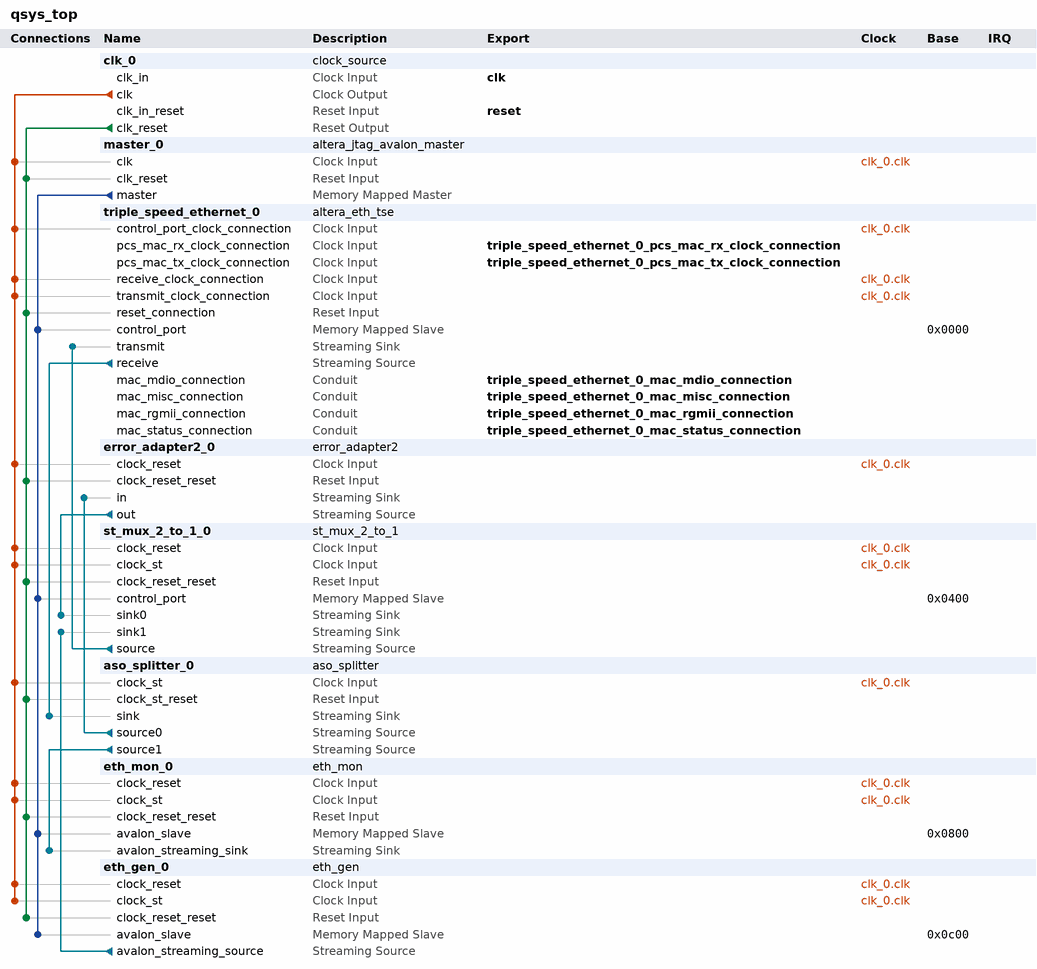
[diagram p0: system contents]
# Platform Designer (Qsys) system qsys_top, MAX 10 10M50DAF484C6GES
# Parameters at their usual value, and those the tool derives, are not listed.
package require -exact qsys 15.1
create_system qsys_top
set_project_property DEVICE_FAMILY {MAX 10}
set_project_property DEVICE 10M50DAF484C6GES

add_instance clk_0 clock_source 15.1
set_instance_parameter_value clk_0 clockFrequency 100000000

add_instance master_0 altera_jtag_avalon_master 15.1

add_instance triple_speed_ethernet_0 altera_eth_tse 15.1
set_instance_parameter_value triple_speed_ethernet_0 core_variation MAC_ONLY
set_instance_parameter_value triple_speed_ethernet_0 eg_addr 13
set_instance_parameter_value triple_speed_ethernet_0 enable_gmii_loopback true
set_instance_parameter_value triple_speed_ethernet_0 enable_hd_logic true
set_instance_parameter_value triple_speed_ethernet_0 enable_mac_flow_ctrl true
set_instance_parameter_value triple_speed_ethernet_0 enable_magic_detect false
set_instance_parameter_value triple_speed_ethernet_0 enable_shift16 true
set_instance_parameter_value triple_speed_ethernet_0 ifGMII RGMII
set_instance_parameter_value triple_speed_ethernet_0 ing_addr 13
set_instance_parameter_value triple_speed_ethernet_0 mdio_clk_div 50
set_instance_parameter_value triple_speed_ethernet_0 stat_cnt_ena true
set_instance_parameter_value triple_speed_ethernet_0 transceiver_type NONE

add_instance error_adapter2_0 error_adapter2 1.0
set_instance_parameter_value error_adapter2_0 data_width 32
set_instance_parameter_value error_adapter2_0 empty_width 2
set_instance_parameter_value error_adapter2_0 in_error_width 6
set_instance_parameter_value error_adapter2_0 out_error_width 1

add_instance st_mux_2_to_1_0 st_mux_2_to_1 1.0

add_instance aso_splitter_0 aso_splitter 1.0

add_instance eth_mon_0 eth_mon 1.0

add_instance eth_gen_0 eth_gen 1.0
set_instance_parameter_value eth_gen_0 state_data 5
set_instance_parameter_value eth_gen_0 state_dest 1
set_instance_parameter_value eth_gen_0 state_dest_src 2
set_instance_parameter_value eth_gen_0 state_idle 0
set_instance_parameter_value eth_gen_0 state_len_seq 4
set_instance_parameter_value eth_gen_0 state_src 3
set_instance_parameter_value eth_gen_0 state_transition 6

# connections
add_connection clk_0.clk aso_splitter_0.clock_st clock
add_connection clk_0.clk error_adapter2_0.clock_reset clock
add_connection clk_0.clk eth_gen_0.clock_reset clock
add_connection clk_0.clk eth_gen_0.clock_st clock
add_connection clk_0.clk eth_mon_0.clock_reset clock
add_connection clk_0.clk eth_mon_0.clock_st clock
add_connection clk_0.clk master_0.clk clock
add_connection clk_0.clk st_mux_2_to_1_0.clock_reset clock
add_connection clk_0.clk st_mux_2_to_1_0.clock_st clock
add_connection clk_0.clk triple_speed_ethernet_0.control_port_clock_connection clock
add_connection clk_0.clk triple_speed_ethernet_0.receive_clock_connection clock
add_connection clk_0.clk triple_speed_ethernet_0.transmit_clock_connection clock
add_connection clk_0.clk_reset aso_splitter_0.clock_st_reset reset
add_connection clk_0.clk_reset error_adapter2_0.clock_reset_reset reset
add_connection clk_0.clk_reset eth_gen_0.clock_reset_reset reset
add_connection clk_0.clk_reset eth_mon_0.clock_reset_reset reset
add_connection clk_0.clk_reset master_0.clk_reset reset
add_connection clk_0.clk_reset st_mux_2_to_1_0.clock_reset_reset reset
add_connection clk_0.clk_reset triple_speed_ethernet_0.reset_connection reset
add_connection master_0.master eth_gen_0.avalon_slave avalon
set_connection_parameter_value master_0.master/eth_gen_0.avalon_slave baseAddress 0x0c00
add_connection master_0.master eth_mon_0.avalon_slave avalon
set_connection_parameter_value master_0.master/eth_mon_0.avalon_slave baseAddress 0x0800
add_connection master_0.master st_mux_2_to_1_0.control_port avalon
set_connection_parameter_value master_0.master/st_mux_2_to_1_0.control_port baseAddress 0x0400
add_connection master_0.master triple_speed_ethernet_0.control_port avalon
set_connection_parameter_value master_0.master/triple_speed_ethernet_0.control_port baseAddress 0x0000
add_connection aso_splitter_0.source0 error_adapter2_0.in avalon_streaming
add_connection aso_splitter_0.source1 eth_mon_0.avalon_streaming_sink avalon_streaming
add_connection error_adapter2_0.out st_mux_2_to_1_0.sink0 avalon_streaming
add_connection eth_gen_0.avalon_streaming_source st_mux_2_to_1_0.sink1 avalon_streaming
add_connection st_mux_2_to_1_0.source triple_speed_ethernet_0.transmit avalon_streaming
add_connection triple_speed_ethernet_0.receive aso_splitter_0.sink avalon_streaming

# exported interfaces
add_interface clk clock sink
set_interface_property clk EXPORT_OF clk_0.clk_in
add_interface reset reset sink
set_interface_property reset EXPORT_OF clk_0.clk_in_reset
add_interface triple_speed_ethernet_0_mac_mdio_connection conduit end
set_interface_property triple_speed_ethernet_0_mac_mdio_connection EXPORT_OF triple_speed_ethernet_0.mac_mdio_connection
add_interface triple_speed_ethernet_0_mac_misc_connection conduit end
set_interface_property triple_speed_ethernet_0_mac_misc_connection EXPORT_OF triple_speed_ethernet_0.mac_misc_connection
add_interface triple_speed_ethernet_0_mac_rgmii_connection conduit end
set_interface_property triple_speed_ethernet_0_mac_rgmii_connection EXPORT_OF triple_speed_ethernet_0.mac_rgmii_connection
add_interface triple_speed_ethernet_0_mac_status_connection conduit end
set_interface_property triple_speed_ethernet_0_mac_status_connection EXPORT_OF triple_speed_ethernet_0.mac_status_connection
add_interface triple_speed_ethernet_0_pcs_mac_rx_clock_connection clock sink
set_interface_property triple_speed_ethernet_0_pcs_mac_rx_clock_connection EXPORT_OF triple_speed_ethernet_0.pcs_mac_rx_clock_connection
add_interface triple_speed_ethernet_0_pcs_mac_tx_clock_connection clock sink
set_interface_property triple_speed_ethernet_0_pcs_mac_tx_clock_connection EXPORT_OF triple_speed_ethernet_0.pcs_mac_tx_clock_connection

set_interconnect_requirement {$system} qsys_mm.clockCrossingAdapter HANDSHAKE
set_interconnect_requirement {$system} qsys_mm.maxAdditionalLatency 1

save_system qsys_top.qsys
